# Altium schematic sheet FPGA核心板03.SchDoc
size A4
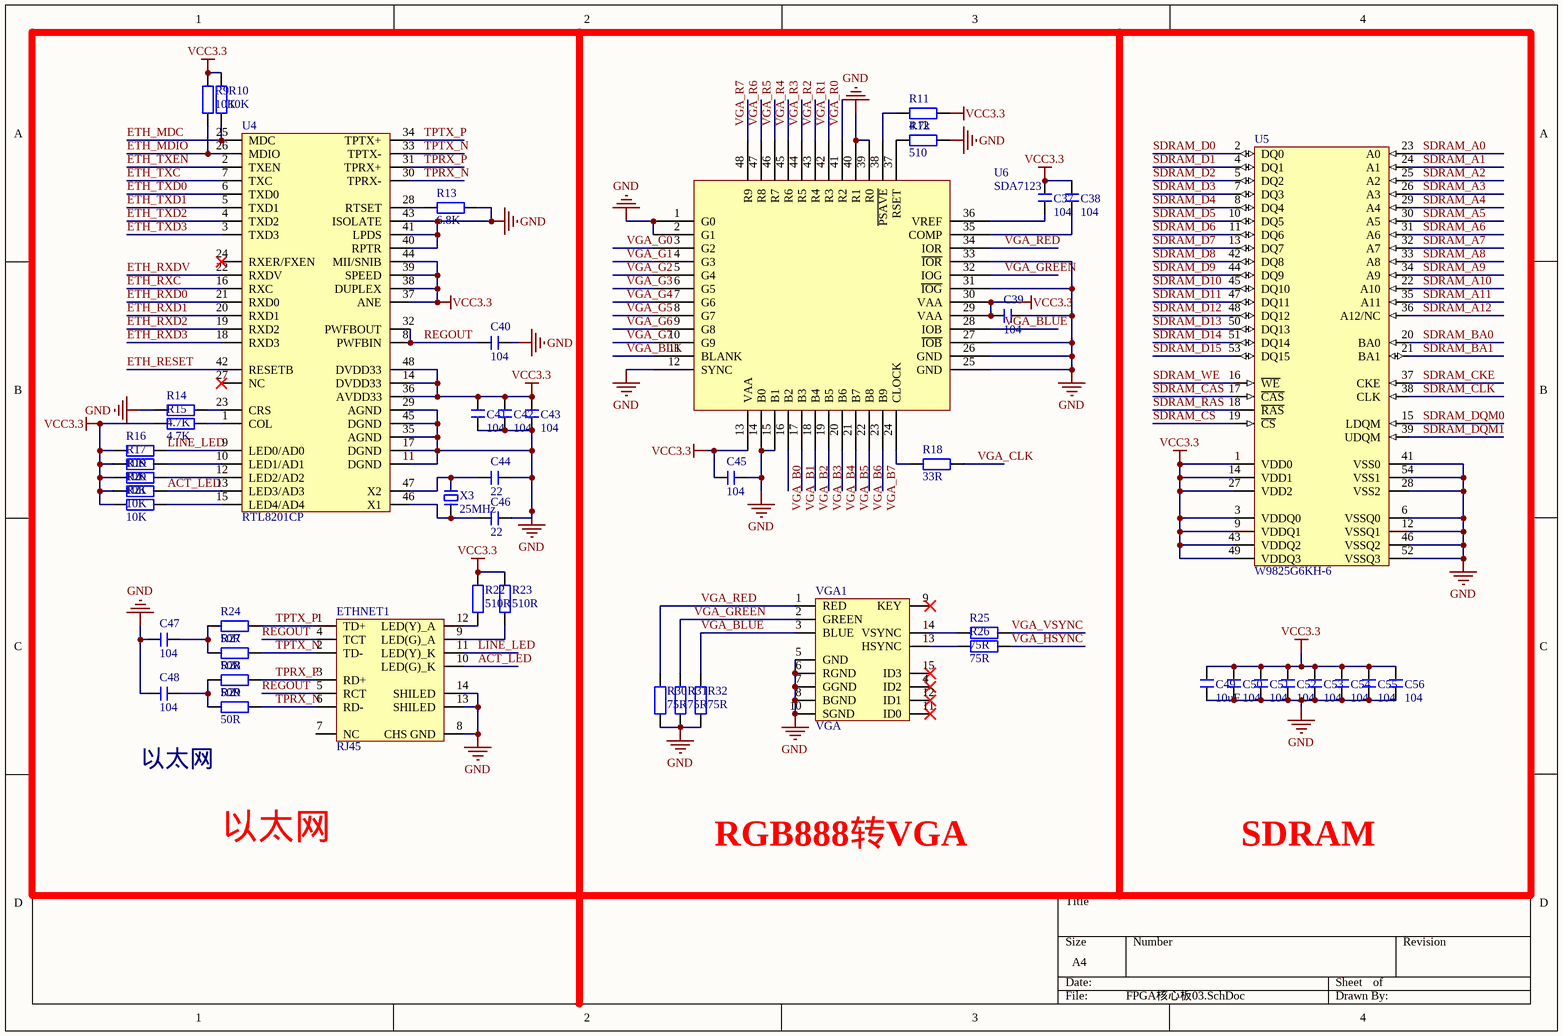
[diagram p0: FPGA核心板03.SchDoc]

## Parts
C37  104  [C 0603_L]
C38  104  [C 0603_L]
C39  104  [C 0603_L]
C40  104  [C 0603_L]
C41  104  [C 0603_L]
C42  104  [C 0603_L]
C43  104  [C 0603_L]
C44  22  [C 0603_L]
C45  104  [C 0603_L]
C46  22  [C 0603_L]
C47  104  [C 0603_L]
C48  104  [C 0603_L]
C49  10uF  [C 0603_L]
C50  104  [C 0603_L]
C51  104  [C 0603_L]
C52  104  [C 0603_L]
C53  104  [C 0603_L]
C54  104  [C 0603_L]
C55  104  [C 0603_L]
C56  104  [C 0603_L]
ETHNET1  RJ45  [RJ-45A12]
R9  10K  [R 0603_L]
R10  10K  [R 0603_L]
R11  4.7k  [R 0603_L]
R12  510  [R 0603_L]
R13  6.8K  [R 0603_L]
R14  4.7K  [R 0603_L]
R15  4.7K  [R 0603_L]
R16  10K  [R 0603_L]
R17  10K  [R 0603_L]
R18  33R  [R 0603_L]
R19  10K  [R 0603_L]
R20  10K  [R 0603_L]
R21  10K  [R 0603_L]
R22  510R  [R 0603_L]
R23  510R  [R 0603_L]
R24  50R  [R 0603_L]
R25  75R  [R 0603_L]
R26  75R  [R 0603_L]
R27  50R  [R 0603_L]
R28  50R  [R 0603_L]
R29  50R  [R 0603_L]
R30  75R  [R 0603_L]
R31  75R  [R 0603_L]
R32  75R  [R 0603_L]
U4  RTL8201CP  [LQFP48 7X7_L]
U5  W9825G6KH-6  [TSOP54]
U6  SDA7123  [LQFP48 7X7_N]
VGA1  VGA  [VGA15B]
X3  25MHz  [OSC HC-49S]

## Nets
GND: C39.1 C40.1 C41.1 C42.1 C43.1 C44.2 C45.2 C46.2 C47.2 C48.2 C49.1 C50.1 C51.1 C52.1 C53.1 C54.1 C55.1 C56.1 ETHNET1.8(CHS_GND) ETHNET1.13(SHILED) ETHNET1.14(SHILED) R12.2 R13.2 R14.1 R30.1 R31.1 R32.1 U4.11(DGND) U4.17(DGND) U4.29(AGND) U4.35(AGND) U4.40(RPTR) U4.41(LPDS) U4.43(ISOLATE) U4.45(DGND) U5.6(VSSQ0) U5.12(VSSQ1) U5.28(VSS2) U5.41(VSS0) U5.46(VSSQ2) U5.52(VSSQ3) U5.54(VSS1) U6.1(G0) U6.2(G1) U6.12(SYNC) U6.14(B0) U6.15(B1) U6.25(GND) U6.26(GND) U6.27(~{IOB}) U6.31(~{IOG}) U6.33(~{IOR}) U6.39(R0) U6.40(R1) VGA1.5(GND) VGA1.6(RGND) VGA1.7(GGND) VGA1.8(BGND) VGA1.10(SGND)
VCC3.3: C37.2 C38.2 C39.2 C41.2 C42.2 C43.2 C45.1 C49.2 C50.2 C51.2 C52.2 C53.2 C54.2 C55.2 C56.2 R9.2 R10.2 R11.2 R15.1 R16.1 R17.1 R19.1 R20.1 R21.1 R22.2 R23.2 U4.14(DVDD33) U4.36(AVDD33) U4.37(ANE) U4.38(DUPLEX) U4.39(SPEED) U4.44(MII/SNIB) U4.48(DVDD33) U5.1(VDD0) U5.3(VDDQ0) U5.9(VDDQ1) U5.14(VDD1) U5.27(VDD2) U5.43(VDDQ2) U5.49(VDDQ3) U6.13(VAA) U6.29(VAA) U6.30(VAA)
ACT_LED: ETHNET1.10(LED(G)_K) R20.2 U4.13(LED3/AD3)
ETH_MDC: R10.1 U4.25(MDC)
ETH_MDIO: R9.1 U4.26(MDIO)
ETH_RESET: U4.42(RESETB)
ETH_RXC: U4.16(RXC)
ETH_RXD0: U4.21(RXD0)
ETH_RXD1: U4.20(RXD1)
ETH_RXD2: U4.19(RXD2)
ETH_RXD3: U4.18(RXD3)
ETH_RXDV: U4.22(RXDV)
ETH_TXC: U4.7(TXC)
ETH_TXD0: U4.6(TXD0)
ETH_TXD1: U4.5(TXD1)
ETH_TXD2: U4.4(TXD2)
ETH_TXD3: U4.3(TXD3)
ETH_TXEN: U4.2(TXEN)
LINE_LED: ETHNET1.11(LED(Y)_K) R16.2 U4.9(LED0/AD0)
REGOUT: C40.2 ETHNET1.4(TCT) ETHNET1.5(RCT) U4.8(PWFBIN) U4.32(PWFBOUT)
SDRAM_A0: U5.23(A0)
SDRAM_A1: U5.24(A1)
SDRAM_A2: U5.25(A2)
SDRAM_A3: U5.26(A3)
SDRAM_A4: U5.29(A4)
SDRAM_A5: U5.30(A5)
SDRAM_A6: U5.31(A6)
SDRAM_A7: U5.32(A7)
SDRAM_A8: U5.33(A8)
SDRAM_A9: U5.34(A9)
SDRAM_A10: U5.22(A10)
SDRAM_A11: U5.35(A11)
SDRAM_A12: U5.36(A12/NC)
SDRAM_BA0: U5.20(BA0)
SDRAM_BA1: U5.21(BA1)
SDRAM_CAS: U5.17(~{CAS})
SDRAM_CKE: U5.37(CKE)
SDRAM_CLK: U5.38(CLK)
SDRAM_CS: U5.19(~{CS})
SDRAM_D0: U5.2(DQ0)
SDRAM_D1: U5.4(DQ1)
SDRAM_D2: U5.5(DQ2)
SDRAM_D3: U5.7(DQ3)
SDRAM_D4: U5.8(DQ4)
SDRAM_D5: U5.10(DQ5)
SDRAM_D6: U5.11(DQ6)
SDRAM_D7: U5.13(DQ7)
SDRAM_D8: U5.42(DQ8)
SDRAM_D9: U5.44(DQ9)
SDRAM_D10: U5.45(DQ10)
SDRAM_D11: U5.47(DQ11)
SDRAM_D12: U5.48(DQ12)
SDRAM_D13: U5.50(DQ13)
SDRAM_D14: U5.51(DQ14)
SDRAM_D15: U5.53(DQ15)
SDRAM_DQM0: U5.15(LDQM)
SDRAM_DQM1: U5.39(UDQM)
SDRAM_RAS: U5.18(~{RAS})
SDRAM_WE: U5.16(~{WE})
TPRX_N: ETHNET1.6(RD-) R29.2 U4.30(TPRX-)
TPRX_P: ETHNET1.3(RD+) R28.2 U4.31(TPRX+)
TPTX_N: ETHNET1.2(TD-) R27.2 U4.33(TPTX-)
TPTX_P: ETHNET1.1(TD+) R24.2 U4.34(TPTX+)
VGA_B0: U6.16(B2)
VGA_B1: U6.17(B3)
VGA_B2: U6.18(B4)
VGA_B3: U6.19(B5)
VGA_B4: U6.20(B6)
VGA_B5: U6.21(B7)
VGA_B6: U6.22(B8)
VGA_B7: U6.23(B9)
VGA_BLK: U6.11(BLANK)
VGA_BLUE: R32.2 U6.28(IOB) VGA1.3(BLUE)
VGA_CLK: R18.2
VGA_G0: U6.3(G2)
VGA_G1: U6.4(G3)
VGA_G2: U6.5(G4)
VGA_G3: U6.6(G5)
VGA_G4: U6.7(G6)
VGA_G5: U6.8(G7)
VGA_G6: U6.9(G8)
VGA_G7: U6.10(G9)
VGA_GREEN: R31.2 U6.32(IOG) VGA1.2(GREEN)
VGA_HSYNC: R26.1
VGA_R0: U6.41(R2)
VGA_R1: U6.42(R3)
VGA_R2: U6.43(R4)
VGA_R3: U6.44(R5)
VGA_R4: U6.45(R6)
VGA_R5: U6.46(R7)
VGA_R6: U6.47(R8)
VGA_R7: U6.48(R9)
VGA_RED: R30.2 U6.34(IOR) VGA1.1(RED)
VGA_VSYNC: R25.1
NetC37_1: C37.1 U6.36(VREF)
NetC38_1: C38.1 U6.35(COMP)
NetC44_1: C44.1 U4.47(X2) X3.2
NetC46_1: C46.1 U4.46(X1) X3.1
NetC47_1: C47.1 R24.1 R27.1
NetC48_1: C48.1 R28.1 R29.1
NetETHNET1_9: ETHNET1.9(LED(G)_A) R23.1
NetETHNET1_12: ETHNET1.12(LED(Y)_A) R22.1
NetR11_1: R11.1 U6.38(~{PSAVE})
NetR12_1: R12.1 U6.37(RSET)
NetR13_1: R13.1 U4.28(RTSET)
NetR14_2: R14.2 U4.23(CRS)
NetR15_2: R15.2 U4.1(COL)
NetR17_2: R17.2 U4.10(LED1/AD1)
NetR18_1: R18.1 U6.24(CLOCK)
NetR19_2: R19.2 U4.12(LED2/AD2)
NetR21_2: R21.2 U4.15(LED4/AD4)
NetR25_2: R25.2 VGA1.14(VSYNC)
NetR26_2: R26.2 VGA1.13(HSYNC)

Not connected (* = marked no-connect by the designer): ETHNET1 7(NC); U4 24(RXER/FXEN)* 27(NC)*; VGA1 4(ID2)* 9(KEY)* 11(ID0)* 12(ID1)* 15(ID3)*

## Notes on the sheet
- 以太网
- RGB888转VGA
- SDRAM

## Library data of the parts
C37-C56 = C: 贴片电容; BOM名称: 无极性贴片电容; 淘宝ID: 封装库来自淘宝 ID：黄晶宝石; 联系售后: https://shop463601444.taobao.com
ETHNET1 = HR911105
R9-R32 = R: 贴片电阻; 版权归属: 来自淘宝 ID：黄晶宝石; BOM名称: 贴片电阻; 联系售后: https://shop463601444.taobao.com
U4 = RTL8201CP: ETH PHY
U5 = IS42S16160B: 32MB SDRAM
X3 = XTAL-2P: 2脚无源脚晶振; 版权归属: 源创客; BOM名称: 2脚无源脚晶振; 学习资源: www.ooocke.com